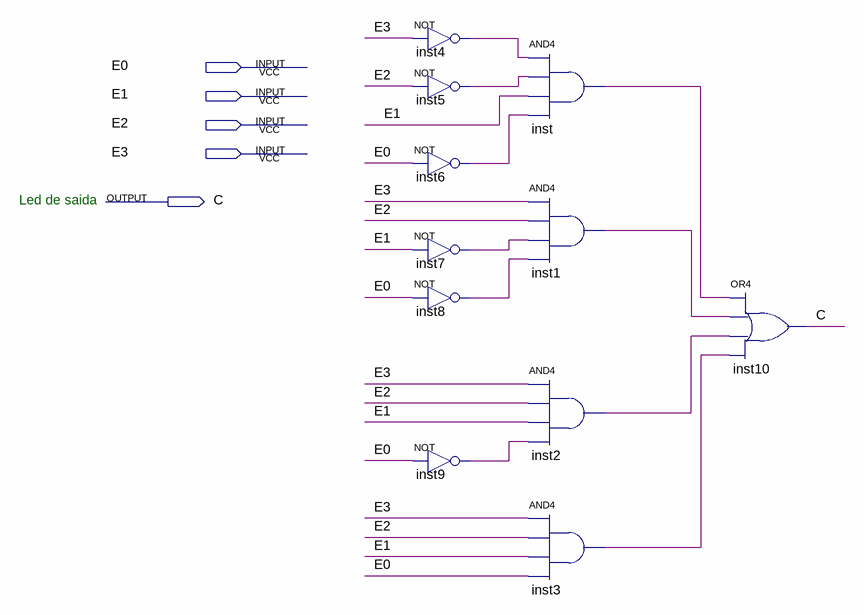
[diagram p0: schematic sheet]
// Quartus schematic C.bdf as structural Verilog: 11 symbols, 5 pins
module C (
  input  E0,
  input  E1,
  input  E2,
  input  E3,
  output C
);

  wire inst1_out, inst2_out, inst3_out, inst4_out, inst5_out, inst6_out, inst7_out, inst8_out, inst9_out,
       inst_out;

  not inst4 (inst4_out, E3);
  not inst5 (inst5_out, E2);
  not inst6 (inst6_out, E0);
  not inst7 (inst7_out, E1);
  not inst8 (inst8_out, E0);
  not inst9 (inst9_out, E0);
  and inst (inst_out, inst4_out, inst5_out, E1, inst6_out);
  and inst1 (inst1_out, E3, E2, inst7_out, inst8_out);
  and inst2 (inst2_out, E3, E2, E1, inst9_out);
  and inst3 (inst3_out, E3, E2, E1, E0);
  or inst10 (C, inst_out, inst1_out, inst2_out, inst3_out);

  // Notes on the sheet:
  //   Led de saida
endmodule
